# EAGLE schematic up_down_buttons (EAGLE 7.2.0)
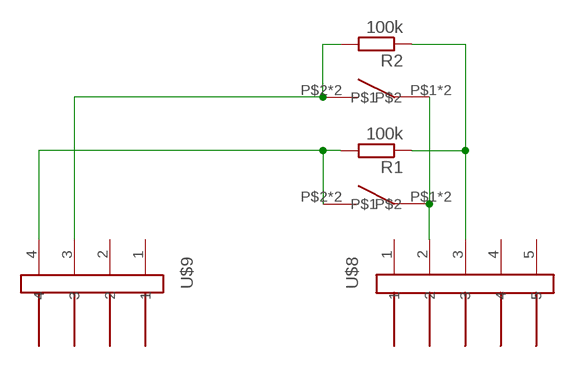
[diagram p0: schematic, sheet 1]

## Parts
R1  100k  R-EU_R0603  [R0603]
R2  100k  R-EU_R0603  [R0603]
U$1  BUTTON_6.3X6.3  [BUTTON_6.2X6.2]
U$2  BUTTON_6.3X6.3  [BUTTON_6.2X6.2]
U$8  JUMPER5M  [JUMPER5M]
U$9  JUMPER4M  [JUMPER4M]

## Nets
GND: R1.1 R2.1 U$8.3
N$1: R2.2 U$2.P$2 U$2.P$4 U$9.3
N$2: U$1.P$1 U$1.P$3 U$2.P$1 U$2.P$3 U$8.2
N$4: R1.2 U$1.P$2 U$1.P$4 U$9.4
Unconnected: U$8.1 U$8.4 U$8.5 U$9.1 U$9.2

## Library data of the parts
R1 R2 = resistor:R-EU_: RESISTOR, European symbol
U$1 U$2 = !stavebnice03:BUTTON_6.3X6.3
U$8 = !stavebnice03:JUMPER5M
U$9 = !stavebnice03:JUMPER4M

## Net classes
0 default: clearance 0.205 mm